# Altium schematic sheet digital.SchDoc: MOSFET DRIVER
size B; Revision: 1.0; SheetNumber: 1; SheetTotal: x; DocumentName: INPUTS
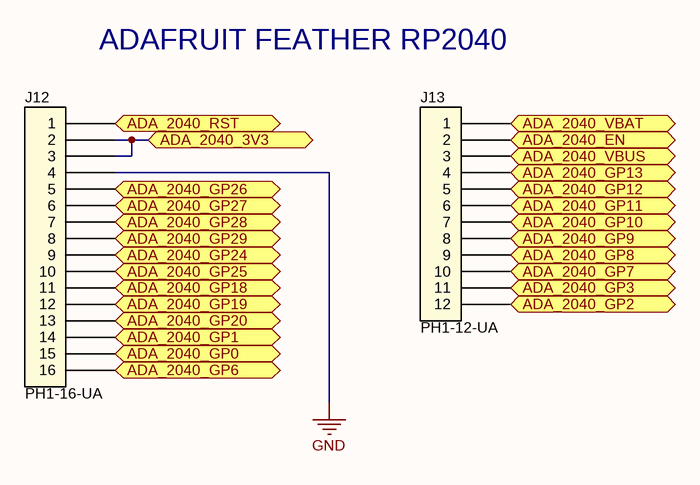
[diagram p0: digital.SchDoc]

## Parts
J12  PH1-16-UA  [CONN_ADAM_TECH_PH1-16-UA]
J13  PH1-12-UA  [CONN_ADAM_TECH_PH1-12-UA]

## Ports
ADA_2040_3V3 (bidir), ADA_2040_EN (bidir), ADA_2040_GP0 (bidir), ADA_2040_GP1 (bidir), ADA_2040_GP2 (bidir), ADA_2040_GP3 (bidir), ADA_2040_GP6 (bidir), ADA_2040_GP7 (bidir), ADA_2040_GP8 (bidir), ADA_2040_GP9 (bidir), ADA_2040_GP10 (bidir), ADA_2040_GP11 (bidir), ADA_2040_GP12 (bidir), ADA_2040_GP13 (bidir), ADA_2040_GP18 (bidir), ADA_2040_GP19 (bidir), ADA_2040_GP20 (bidir), ADA_2040_GP24 (bidir), ADA_2040_GP25 (bidir), ADA_2040_GP26 (bidir), ADA_2040_GP27 (bidir), ADA_2040_GP28 (bidir), ADA_2040_GP29 (bidir), ADA_2040_RST (bidir), ADA_2040_VBAT (bidir), ADA_2040_VBUS (bidir)

## Nets
GND: J12.4
ADA_2040_3V3: J12.2 J12.3 ; port ADA_2040_3V3
ADA_2040_EN: J13.2 ; port ADA_2040_EN
ADA_2040_GP0: J12.15 ; port ADA_2040_GP0
ADA_2040_GP1: J12.14 ; port ADA_2040_GP1
ADA_2040_GP2: J13.12 ; port ADA_2040_GP2
ADA_2040_GP3: J13.11 ; port ADA_2040_GP3
ADA_2040_GP6: J12.16 ; port ADA_2040_GP6
ADA_2040_GP7: J13.10 ; port ADA_2040_GP7
ADA_2040_GP8: J13.9 ; port ADA_2040_GP8
ADA_2040_GP9: J13.8 ; port ADA_2040_GP9
ADA_2040_GP10: J13.7 ; port ADA_2040_GP10
ADA_2040_GP11: J13.6 ; port ADA_2040_GP11
ADA_2040_GP12: J13.5 ; port ADA_2040_GP12
ADA_2040_GP13: J13.4 ; port ADA_2040_GP13
ADA_2040_GP18: J12.11 ; port ADA_2040_GP18
ADA_2040_GP19: J12.12 ; port ADA_2040_GP19
ADA_2040_GP20: J12.13 ; port ADA_2040_GP20
ADA_2040_GP24: J12.9 ; port ADA_2040_GP24
ADA_2040_GP25: J12.10 ; port ADA_2040_GP25
ADA_2040_GP26: J12.5 ; port ADA_2040_GP26
ADA_2040_GP27: J12.6 ; port ADA_2040_GP27
ADA_2040_GP28: J12.7 ; port ADA_2040_GP28
ADA_2040_GP29: J12.8 ; port ADA_2040_GP29
ADA_2040_RST: J12.1 ; port ADA_2040_RST
ADA_2040_VBAT: J13.1 ; port ADA_2040_VBAT
ADA_2040_VBUS: J13.3 ; port ADA_2040_VBUS

## Notes on the sheet
- ADAFRUIT FEATHER RP2040
- Title
- Size:
- Date:
- B
- Number:
- Time:
- Revision:
- Sheet
- of
- File:

## Library data of the parts
J12 = CMP-007-0080: CONN HEADER VERT 16POS 2.54MM GOLD; MFR: Adam Tech; Voltage Rating: 250V AC(RMS)/DC; Durability: 50 mating cycles; Current Rating: 1A; System: Connector; Temp Range: -40 / +105 C; Gender: Male; Value: PH1-16-UA; Orientation: Verticle; Terminal Pitch: 2.54mm; RoHS Compliant: Yes; Design Item ID: CON/16P/2.54mm/2A/PH1-16-UA/Adam Tech; MFR#: PH1-16-UA; Contact Finish: Gold; ComponentLink1Description: Drawing; ComponentLink1URL: https://app.adam-tech.com/products/download/data_sheet/201605/ph1-xx-ua-data-sheet.pdf
J13 = CMP-007-0079: CONN HEADER VERT 12POS 2.54MM GOLD; MFR: Adam Tech; Voltage Rating: 250V AC(RMS)/DC; Durability: 50 mating cycles; Current Rating: 1A; System: Connector; Temp Range: -40 / +105 C; Gender: Male; Value: PH1-12-UA; Orientation: Verticle; Terminal Pitch: 2.54mm; RoHS Compliant: Yes; Design Item ID: CON/12P/2.54mm/2A/PH1-12-UA/Adam Tech; MFR#: PH1-12-UA; Contact Finish: Gold; ComponentLink1Description: Drawing; ComponentLink1URL: https://app.adam-tech.com/products/download/data_sheet/201605/ph1-xx-ua-data-sheet.pdf